# EAGLE design atsams70n-switch (EAGLE 8.3.2)
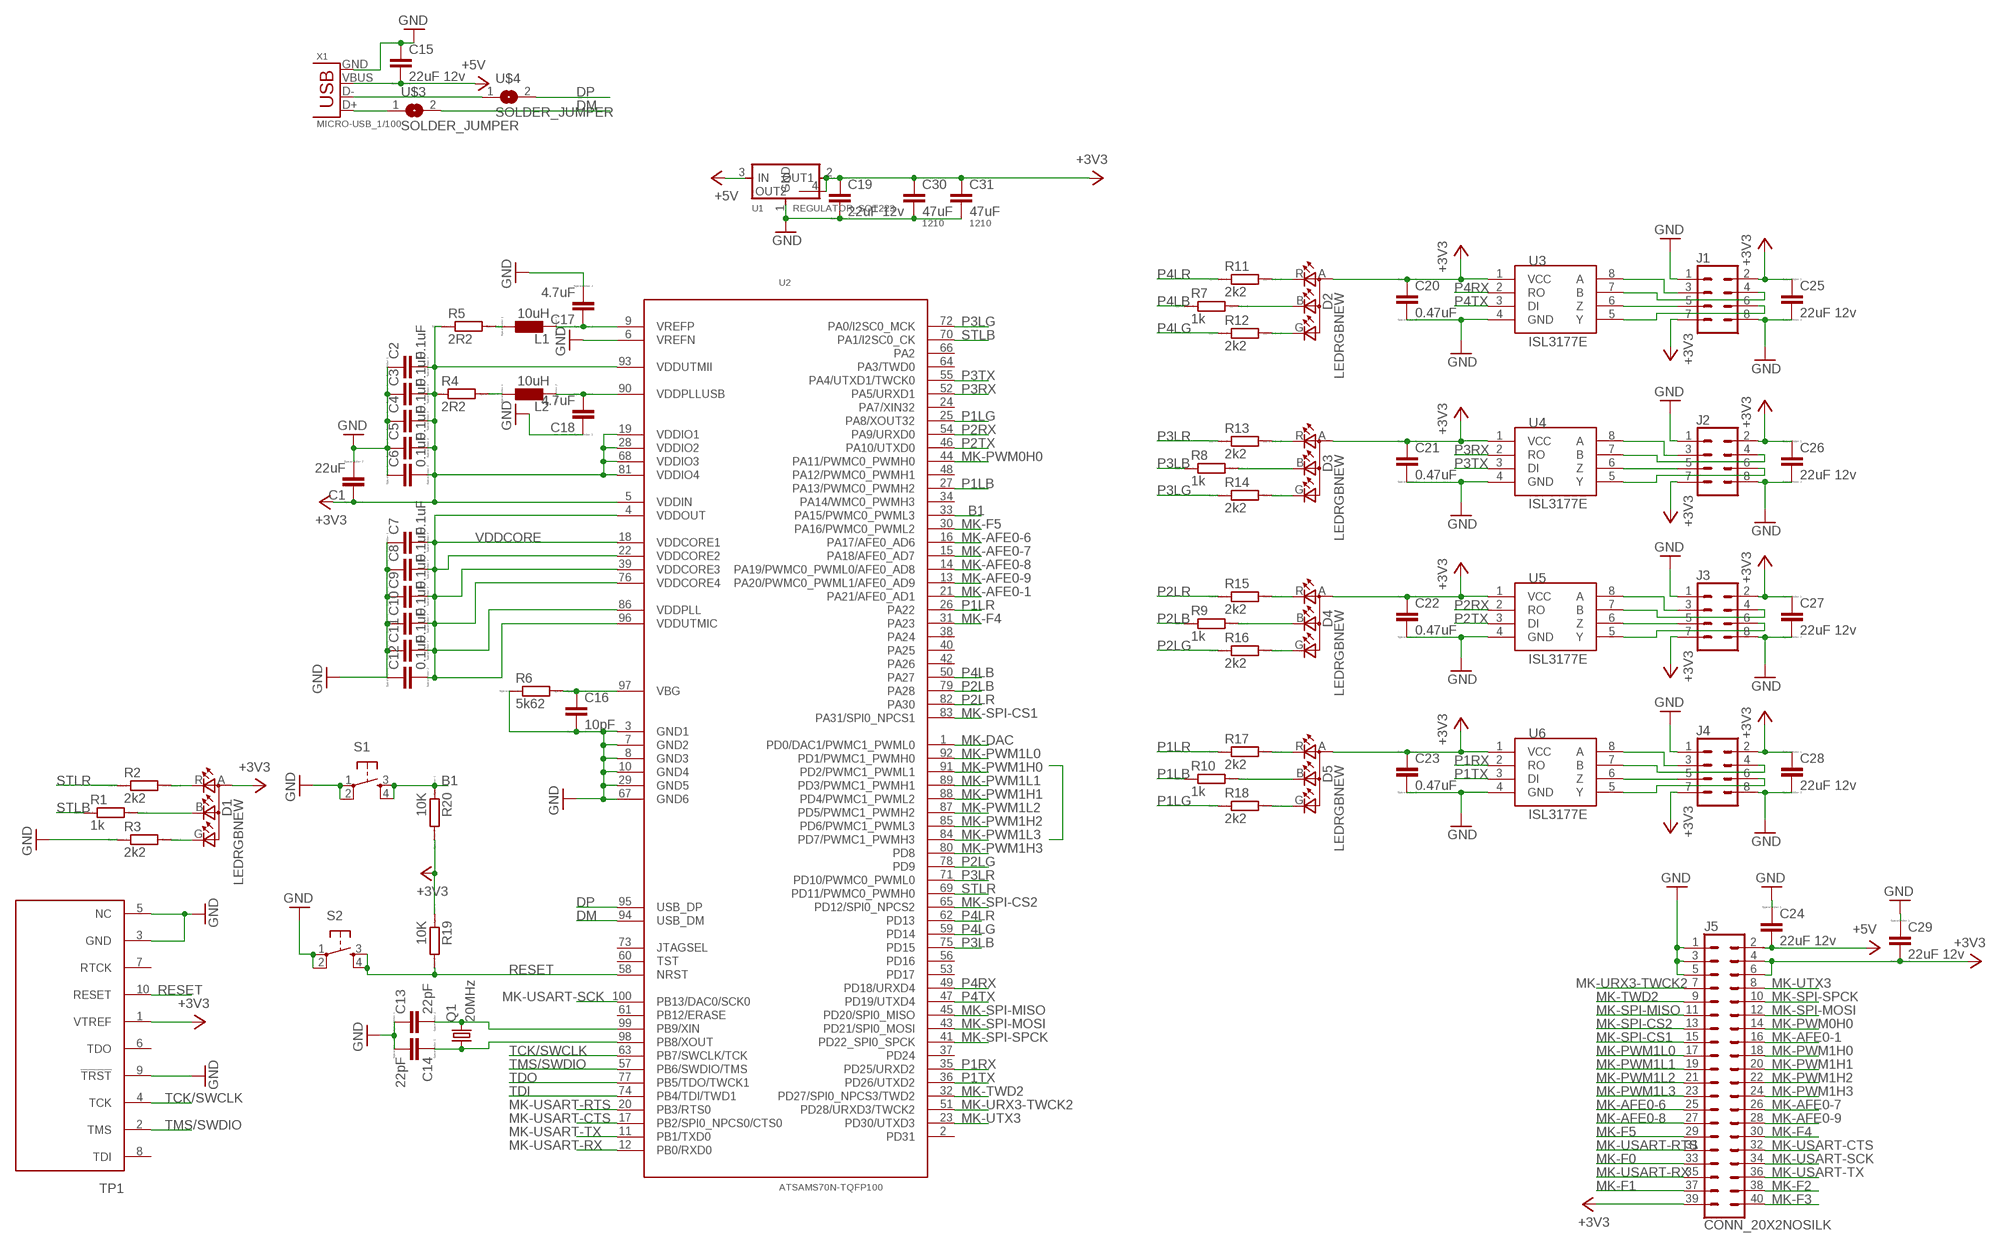
[diagram p0: schematic, sheet 1]

## Parts
C1  22uF  C  [C0805]
C2  0.1uF  CC0603  [C0603]
C3  0.1uF  CC0603  [C0603]
C4  0.1uF  CC0603  [C0603]
C5  0.1uF  CC0603  [C0603]
C6  0.1uF  CC0603  [C0603]
C7  0.1uF  CC0603  [C0603]
C8  0.1uF  CC0603  [C0603]
C9  0.1uF  CC0603  [C0603]
C10  0.1uF  CC0603  [C0603]
C11  0.1uF  CC0603  [C0603]
C12  0.1uF  CC0603  [C0603]
C13  22pF  CC0603  [C0603]
C14  22pF  CC0603  [C0603]
C15  22uF 12v  C  [C0805]
C16  10pF  C  [C0805]
C17  4.7uF  C  [C0805]
C18  4.7uF  C  [C0805]
C19  22uF 12v  C  [C0805]
C20  0.47uF  C  [C0805]
C21  0.47uF  C  [C0805]
C22  0.47uF  C  [C0805]
C23  0.47uF  C  [C0805]
C24  22uF 12v  C  [C0805]
C25  22uF 12v  C  [C0805]
C26  22uF 12v  C  [C0805]
C27  22uF 12v  C  [C0805]
C28  22uF 12v  C  [C0805]
C29  22uF 12v  C  [C0805]
C30  47uF  CAP1210  [1210]
C31  47uF  CAP1210  [1210]
D1  LEDRGBNEW  [P-LCC-4]
D2  LEDRGBNEW  [P-LCC-4]
D3  LEDRGBNEW  [P-LCC-4]
D4  LEDRGBNEW  [P-LCC-4]
D5  LEDRGBNEW  [P-LCC-4]
J1  CONN_04X2SHROUDED  [2X4-SHROUDED]
J2  CONN_04X2SHROUDED  [2X4-SHROUDED]
J3  CONN_04X2SHROUDED  [2X4-SHROUDED]
J4  CONN_04X2SHROUDED  [2X4-SHROUDED]
J5  CONN_20X2NOSILK  [2X20_NOSILK]
L1  10uH  L  [L1812]
L2  10uH  L  [L1812]
Q1  20MHz  CRYSTALCTS406  [CTS406]
R1  1k  R  [R0805]
R2  2k2  R  [R0805]
R3  2k2  R  [R0805]
R4  2R2  R  [R0805]
R5  2R2  R  [R0805]
R6  5k62  R  [R0805]
R7  1k  R  [R0805]
R8  1k  R  [R0805]
R9  1k  R  [R0805]
R10  1k  R  [R0805]
R11  2k2  R  [R0805]
R12  2k2  R  [R0805]
R13  2k2  R  [R0805]
R14  2k2  R  [R0805]
R15  2k2  R  [R0805]
R16  2k2  R  [R0805]
R17  2k2  R  [R0805]
R18  2k2  R  [R0805]
R19  10K  R  [R0805]
R20  10K  R  [R0805]
S1  6MM_SWITCH6MM_SWITCH  [6MM_SWITCH]
S2  6MM_SWITCH6MM_SWITCH  [6MM_SWITCH]
TP1  TC2050-NL  [TC2050-MCP]
U1  REGULATOR_SOT223  [SOT223]
U2  ATSAMS70N-TQFP100  [TQFP100-14X14]
U3  ISL3177E  [MSOP8]
U4  ISL3177E  [MSOP8]
U5  ISL3177E  [MSOP8]
U6  ISL3177E  [MSOP8]
U$3  SOLDER_JUMPER  [SJFAB]
U$4  SOLDER_JUMPER  [SJFAB]
X1  MICRO-USB_1/100  [DX4R005HJ5_100]

## Nets
+3V3: C1.1 C2.2 C3.2 C4.2 C5.2 C6.2 C19.1 C20.1 C21.1 C22.1 C23.1 C25.1 C26.1 C27.1 C28.1 C29.2 C30.1 C31.1 D1.A(A2) D2.A(A2) D3.A(A2) D4.A(A2) D5.A(A2) J1.2 J1.7 J2.2 J2.7 J3.2 J3.7 J4.2 J4.7 J5.4 J5.6 J5.39 R4.1 R5.1 R19.1 R20.2 TP1.1(VTREF) U1.2(OUT1) U1.4(OUT2) U2.5(VDDIN) U2.19(VDDIO1) U2.28(VDDIO2) U2.68(VDDIO3) U2.81(VDDIO4) U2.93(VDDUTMII) U3.1(VCC) U4.1(VCC) U5.1(VCC) U6.1(VCC)
+5V: C15.2 C24.2 J5.2 U1.3(IN) X1.VBUS
B1: R20.1 S1.3(S) S1.4(S1) U2.33(PA15/PWMC0_PWML3)
DM: U2.94(USB_DM) U$3.2
DP: U2.95(USB_DP) U$4.2
GND: C1.2 C2.1 C3.1 C4.1 C5.1 C6.1 C7.1 C8.1 C9.1 C10.1 C11.1 C12.1 C13.1 C14.2 C15.1 C16.2 C17.2 C18.1 C19.2 C20.2 C21.2 C22.2 C23.2 C24.1 C25.2 C26.2 C27.2 C28.2 C29.1 C30.2 C31.2 J1.1 J1.8 J2.1 J2.8 J3.1 J3.8 J4.1 J4.8 J5.1 J5.3 J5.5 R3.1 R6.1 S1.1(P) S1.2(P1) S2.1(P) S2.2(P1) TP1.3(GND) TP1.5(NC) TP1.9(!TRST) U1.1(GND) U2.3(GND1) U2.6(VREFN) U2.7(GND2) U2.8(GND3) U2.10(GND4) U2.29(GND5) U2.67(GND6) U3.4(GND) U4.4(GND) U5.4(GND) U6.4(GND) X1.GND
MK-AFE0-1: J5.16 U2.21(PA21/AFE0_AD1)
MK-AFE0-6: J5.25 U2.16(PA17/AFE0_AD6)
MK-AFE0-7: J5.26 U2.15(PA18/AFE0_AD7)
MK-AFE0-8: J5.27 U2.14(PA19/PWMC0_PWML0/AFE0_AD8)
MK-AFE0-9: J5.28 U2.13(PA20/PWMC0_PWML1/AFE0_AD9)
MK-DAC: U2.1(PD0/DAC1/PWMC1_PWML0)
MK-F0: J5.33
MK-F1: J5.37
MK-F2: J5.38
MK-F3: J5.40
MK-F4: J5.30 U2.31(PA23)
MK-F5: J5.29 U2.30(PA16/PWMC0_PWML2)
MK-PWM0H0: J5.14 U2.44(PA11/PWMC0_PWMH0)
MK-PWM1H0: J5.18 U2.91(PD2/PWMC1_PWML1)
MK-PWM1H1: J5.20 U2.88(PD4/PWMC1_PWML2)
MK-PWM1H2: J5.22 U2.85(PD6/PWMC1_PWML3)
MK-PWM1H3: J5.24 U2.80(PD8)
MK-PWM1L0: J5.17 U2.92(PD1/PWMC1_PWMH0)
MK-PWM1L1: J5.19 U2.89(PD3/PWMC1_PWMH1)
MK-PWM1L2: J5.21 U2.87(PD5/PWMC1_PWMH2)
MK-PWM1L3: J5.23 U2.84(PD7/PWMC1_PWMH3)
MK-SPI-CS1: J5.15 U2.83(PA31/SPI0_NPCS1)
MK-SPI-CS2: J5.13 U2.65(PD12/SPI0_NPCS2)
MK-SPI-MISO: J5.11 U2.45(PD20/SPI0_MISO)
MK-SPI-MOSI: J5.12 U2.43(PD21/SPI0_MOSI)
MK-SPI-SPCK: J5.10 U2.41(PD22_SPI0_SPCK)
MK-TWD2: J5.9 U2.32(PD27/SPI0_NPCS3/TWD2)
MK-URX3-TWCK2: J5.7 U2.51(PD28/URXD3/TWCK2)
MK-USART-CTS: J5.32 U2.17(PB2/SPI0_NPCS0/CTS0)
MK-USART-RTS: J5.31 U2.20(PB3/RTS0)
MK-USART-RX: J5.35 U2.12(PB0/RXD0)
MK-USART-SCK: J5.34 U2.100(PB13/DAC0/SCK0)
MK-USART-TX: J5.36 U2.11(PB1/TXD0)
MK-UTX3: J5.8 U2.23(PD30/UTXD3)
N$1: D5.R(CRED) R17.2
N$2: D5.B(CBLUE) R10.2
N$3: D5.G(CGREEN) R18.2
N$4: C13.2 Q1.3 U2.99(PB9/XIN)
N$5: C14.1 Q1.1 U2.98(PB8/XOUT)
N$6: U$4.1 X1.D-
N$7: C16.1 R6.2 U2.97(VBG)
N$8: L2.1 R4.2
N$9: L1.1 R5.2
N$10: C18.2 L2.2 U2.90(VDDPLLUSB)
N$11: C17.1 L1.2 U2.9(VREFP)
N$12: D1.R(CRED) R2.2
N$13: J3.3 U5.8(A)
N$14: J3.4 U5.7(B)
N$15: J3.5 U5.6(Z)
N$16: J3.6 U5.5(Y)
N$17: D4.R(CRED) R15.2
N$18: D4.B(CBLUE) R9.2
N$19: D4.G(CGREEN) R16.2
N$20: J2.3 U4.8(A)
N$21: J2.4 U4.7(B)
N$22: J2.5 U4.6(Z)
N$23: J2.6 U4.5(Y)
N$24: D3.R(CRED) R13.2
N$25: J4.3 U6.8(A)
N$26: J4.4 U6.7(B)
N$27: J4.5 U6.6(Z)
N$28: J4.6 U6.5(Y)
N$29: D3.B(CBLUE) R8.2
N$30: D3.G(CGREEN) R14.2
N$31: J1.3 U3.8(A)
N$32: J1.4 U3.7(B)
N$33: J1.5 U3.6(Z)
N$34: J1.6 U3.5(Y)
N$35: D2.R(CRED) R11.2
N$36: D2.B(CBLUE) R7.2
N$37: D2.G(CGREEN) R12.2
N$38: D1.B(CBLUE) R1.2
N$39: D1.G(CGREEN) R3.2
N$40: U$3.1 X1.D+
P1LB: R10.1 U2.27(PA13/PWMC0_PWMH2)
P1LG: R18.1 U2.25(PA8/XOUT32)
P1LR: R17.1 U2.26(PA22)
P1RX: U2.35(PD25/URXD2) U6.2(RO)
P1TX: U2.36(PD26/UTXD2) U6.3(DI)
P2LB: R9.1 U2.79(PA28)
P2LG: R16.1 U2.78(PD9)
P2LR: R15.1 U2.82(PA30)
P2RX: U2.54(PA9/URXD0) U5.2(RO)
P2TX: U2.46(PA10/UTXD0) U5.3(DI)
P3LB: R8.1 U2.75(PD15)
P3LG: R14.1 U2.72(PA0/I2SC0_MCK)
P3LR: R13.1 U2.71(PD10/PWMC0_PWML0)
P3RX: U2.52(PA5/URXD1) U4.2(RO)
P3TX: U2.55(PA4/UTXD1/TWCK0) U4.3(DI)
P4LB: R7.1 U2.50(PA27)
P4LG: R12.1 U2.59(PD14)
P4LR: R11.1 U2.62(PD13)
P4RX: U2.49(PD18/URXD4) U3.2(RO)
P4TX: U2.47(PD19/UTXD4) U3.3(DI)
RESET: R19.2 S2.3(S) S2.4(S1) TP1.10(RESET) U2.58(NRST)
STLB: R1.1 U2.70(PA1/I2SC0_CK)
STLR: R2.1 U2.69(PD11/PWMC0_PWMH0)
TCK/SWCLK: TP1.4(TCK) U2.63(PB7/SWCLK/TCK)
TDI: U2.74(PB4/TDI/TWD1)
TDO: U2.77(PB5/TDO/TWCK1)
TMS/SWDIO: TP1.2(TMS) U2.57(PB6/SWDIO/TMS)
VDDCORE: C7.2 C8.2 C9.2 C10.2 C11.2 C12.2 U2.4(VDDOUT) U2.18(VDDCORE1) U2.22(VDDCORE2) U2.39(VDDCORE3) U2.76(VDDCORE4) U2.86(VDDPLL) U2.96(VDDUTMIC)
Unconnected: TP1.6(TDO) TP1.7(RTCK) TP1.8(TDI) U2.2(PD31) U2.24(PA7/XIN32) U2.34(PA14/WMC0_PWMH3) U2.37(PD24) U2.38(PA24) U2.40(PA25) U2.42(PA26) U2.48(PA12/PWMC0_PWMH1) U2.53(PD17) U2.56(PD16) U2.60(TST) U2.61(PB12/ERASE) U2.64(PA3/TWD0) U2.66(PA2) U2.73(JTAGSEL)

## Library data of the parts
C1-C29 = eagle-ltspice:C: CAPACITOR, European symbol; SPICEMODEL: NONE; SPICEPREFIX: C
C30 C31 = borkedlabs-passives:CAP: Capacitor Standard 0603 ceramic capacitor, and 0.1" leaded capacitor.; PACKAGE: 1210
D1-D5 = fab:LEDRGBNEW
J1-J4 = fab:CONN_04X2: Multi connection point. Often used as Generic Header-pin footprint for 0.1 inch spaced/style header connections On any of the 0.1 inch spaced packages, you can populate with these: Break Away Headers - Straight <https://www.sparkfun.com/products/116> (PRT-00116) Break Away Male Headers - Right Angle <https://www.sparkfun.com/products/553> (PRT-00553) Female Headers <https://www.sparkfun.com/products/115> (PRT-00115) Break Away Headers - Machine Pin <https://www.sparkfun.com/products/117> (PRT-00117) Break Away Female Headers - Swiss Machine Pin <https://www.sparkfun.com/products/743> (PRT-00743)
J5 = SparkFun-Connectors:CONN_20X2: Multi connection point. Often used as Generic Header-pin footprint for 0.1 inch spaced/style header connections On any of the 0.1 inch spaced packages, you can populate with these: Break Away Headers - Straight <https://www.sparkfun.com/products/116> (PRT-00116) Break Away Male Headers - Right Angle <https://www.sparkfun.com/products/553> (PRT-00553) Female Headers <https://www.sparkfun.com/products/115> (PRT-00115) Break Away Headers - Machine Pin <https://www.sparkfun.com/products/117> (PRT-00117) Break Away Female Headers - Swiss Machine Pin <https://www.sparkfun.com/products/743> (PRT-00743)
L1 L2 = eagle-ltspice:L: INDUCTOR, European symbol; SPICEMODEL: NONE; SPICEPREFIX: L
Q1 = crystal:CRYSTAL: CRYSTAL; OC_FARNELL: unknown; OC_NEWARK: unknown
R1-R20 = eagle-ltspice:R: RESISTOR, European symbol; SPICEMODEL: NONE; SPICEPREFIX: R
S1 S2 = fab:6MM_SWITCH: OMRON SWITCH
TP1 = tag-connect-2050:TC2050-NL: TAG-CONNECT ISP Connector Manufacturer: Tag-Connect <www.tag-connect.com> Cable for easy In-Circuit PCB Programming. Designed for JTAG 10 pin, suitable for many others. Pin Connection for TC2050 NL. PAD Description 1 VTREF 2 TMS 3 GND 4 TCK 5 NC 6 TDO 7 RTCK 8 TDI 9 !TRST 10 RESET ©2009 ROFA.cz Modified 7/2011 by Tim McCarthy-Smith VIDA Products INC
U1 = fab:REGULATOR_SOT223
U2 = fab:ATSAMS70N-TQFP100
U3-U6 = fab:ISL3177E
U$3 U$4 = fab:SOLDER_JUMPER
X1 = fab:MICRO-USB: SMD micro USB connector as found in the fablab inventory. Three footprint variants included: original, as described by manufacturer's datasheet for milling with the 1/100" bit for milling with the 1/64" bit Made by Zaerc.

## Board
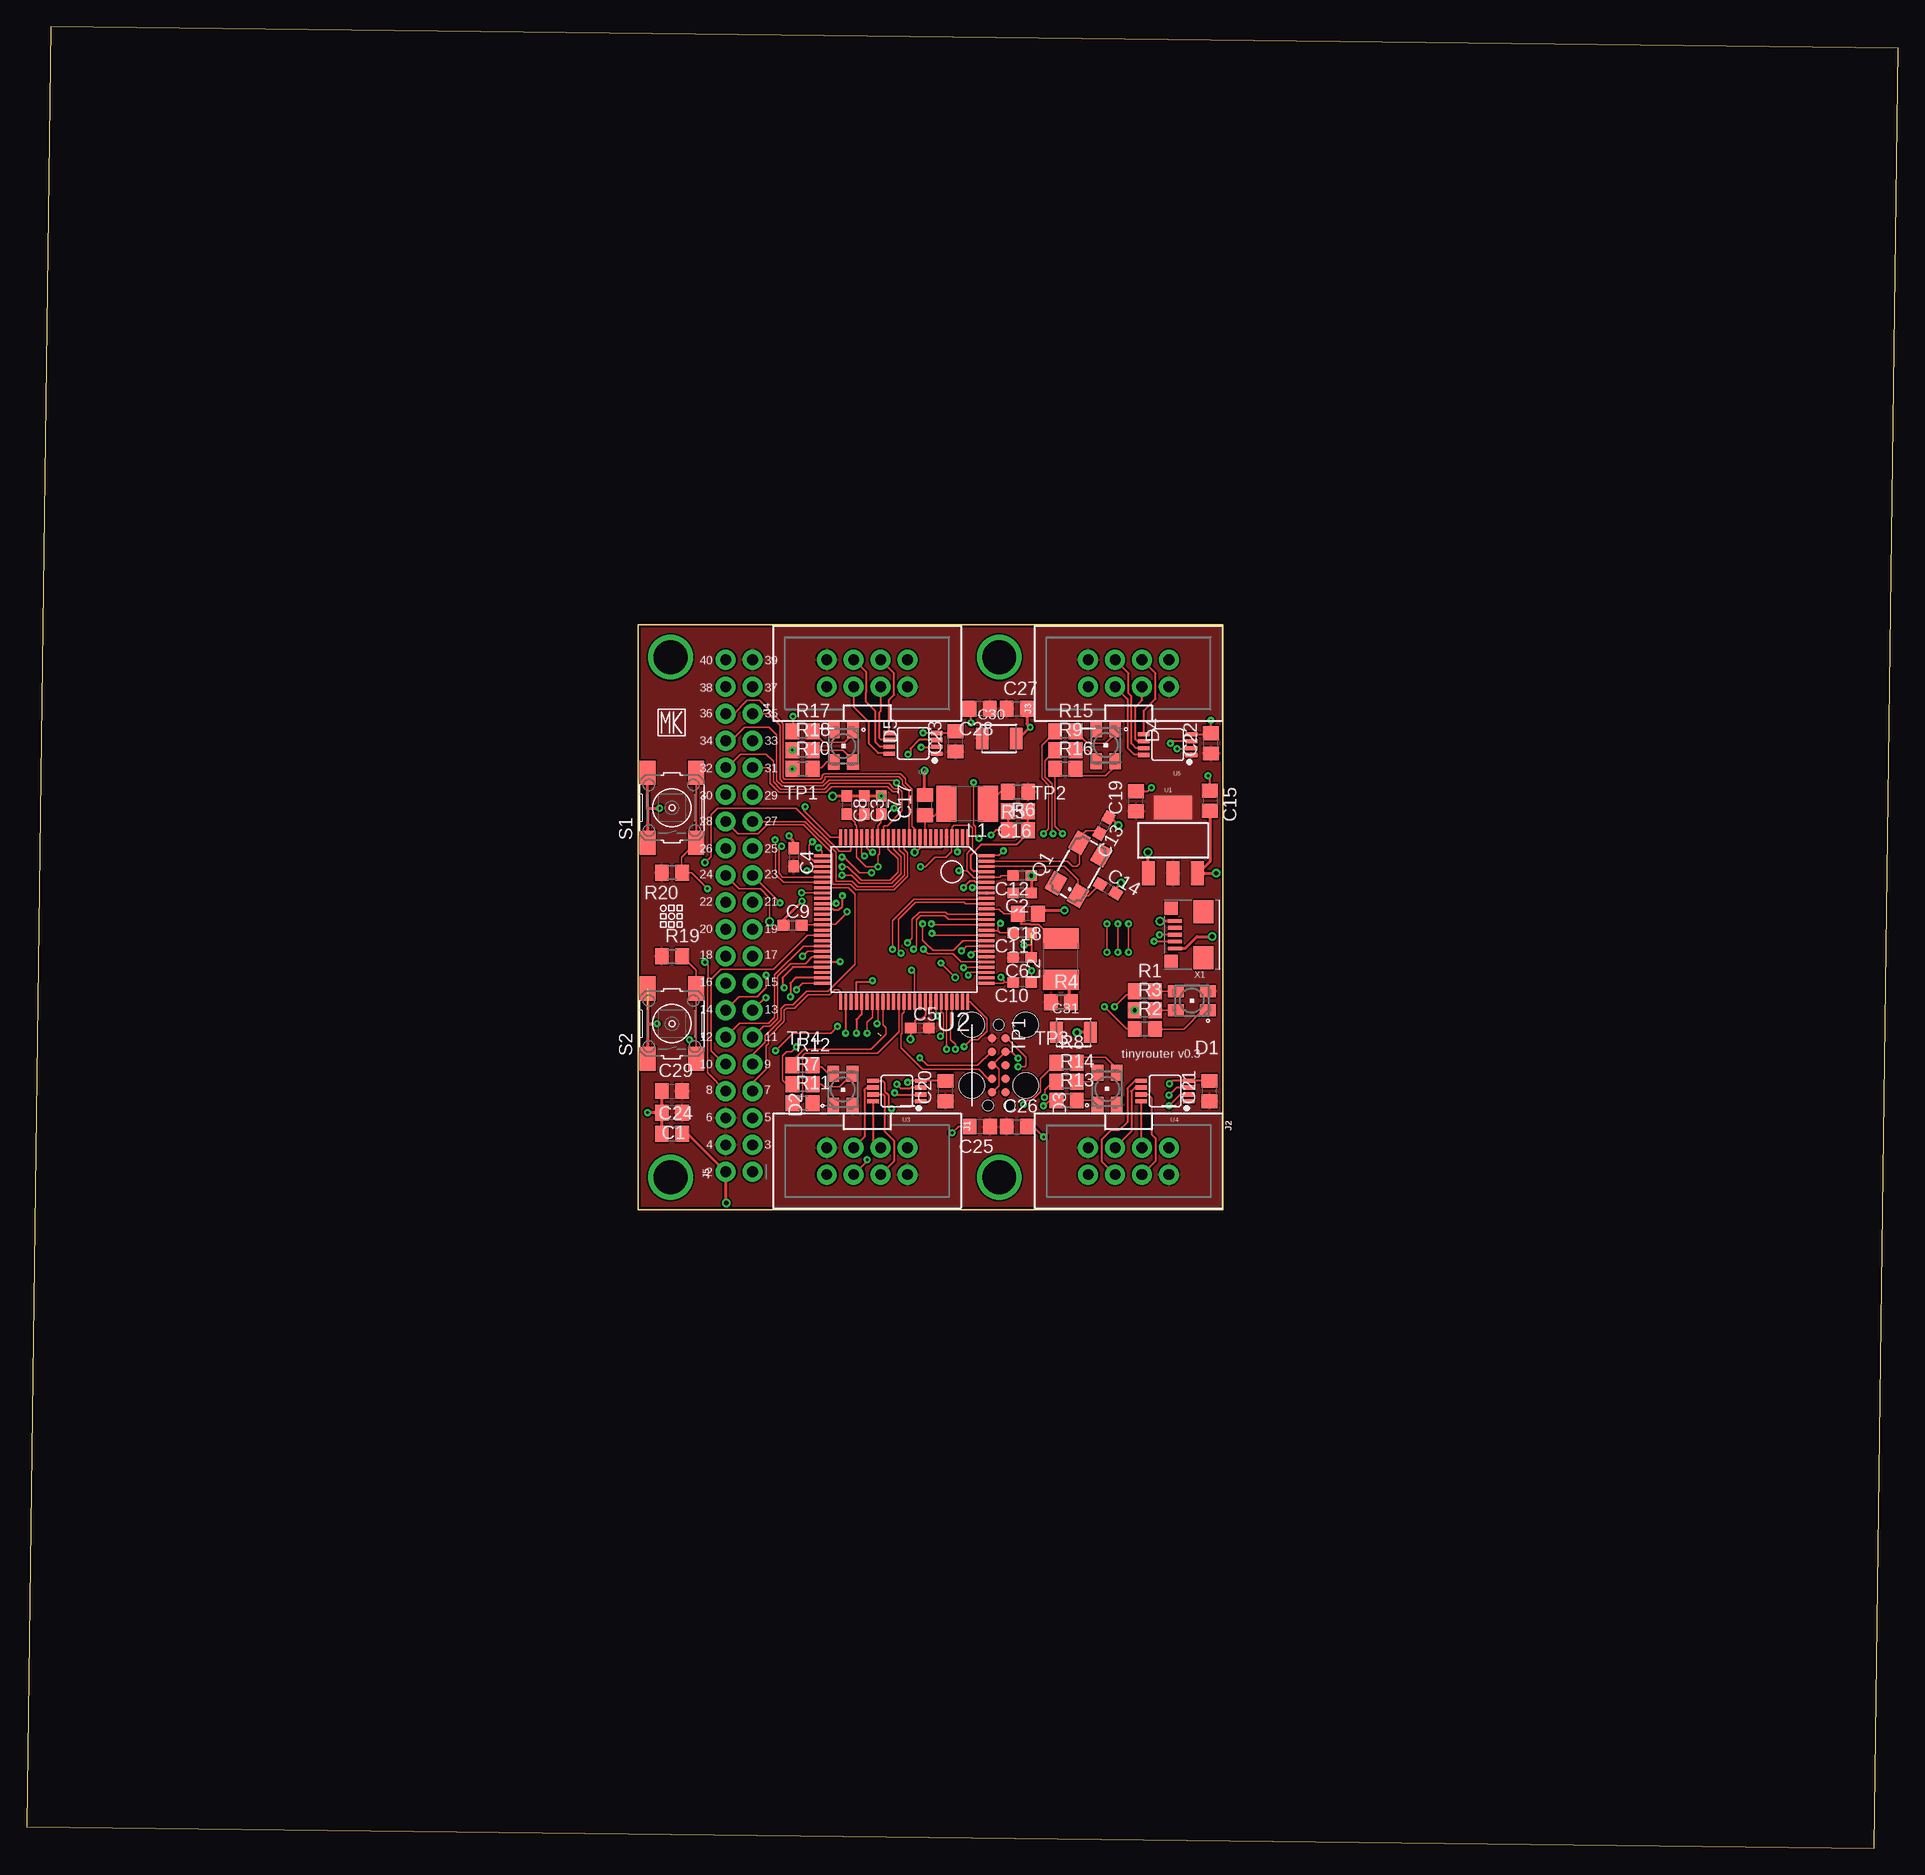
[diagram p1: board, top side]
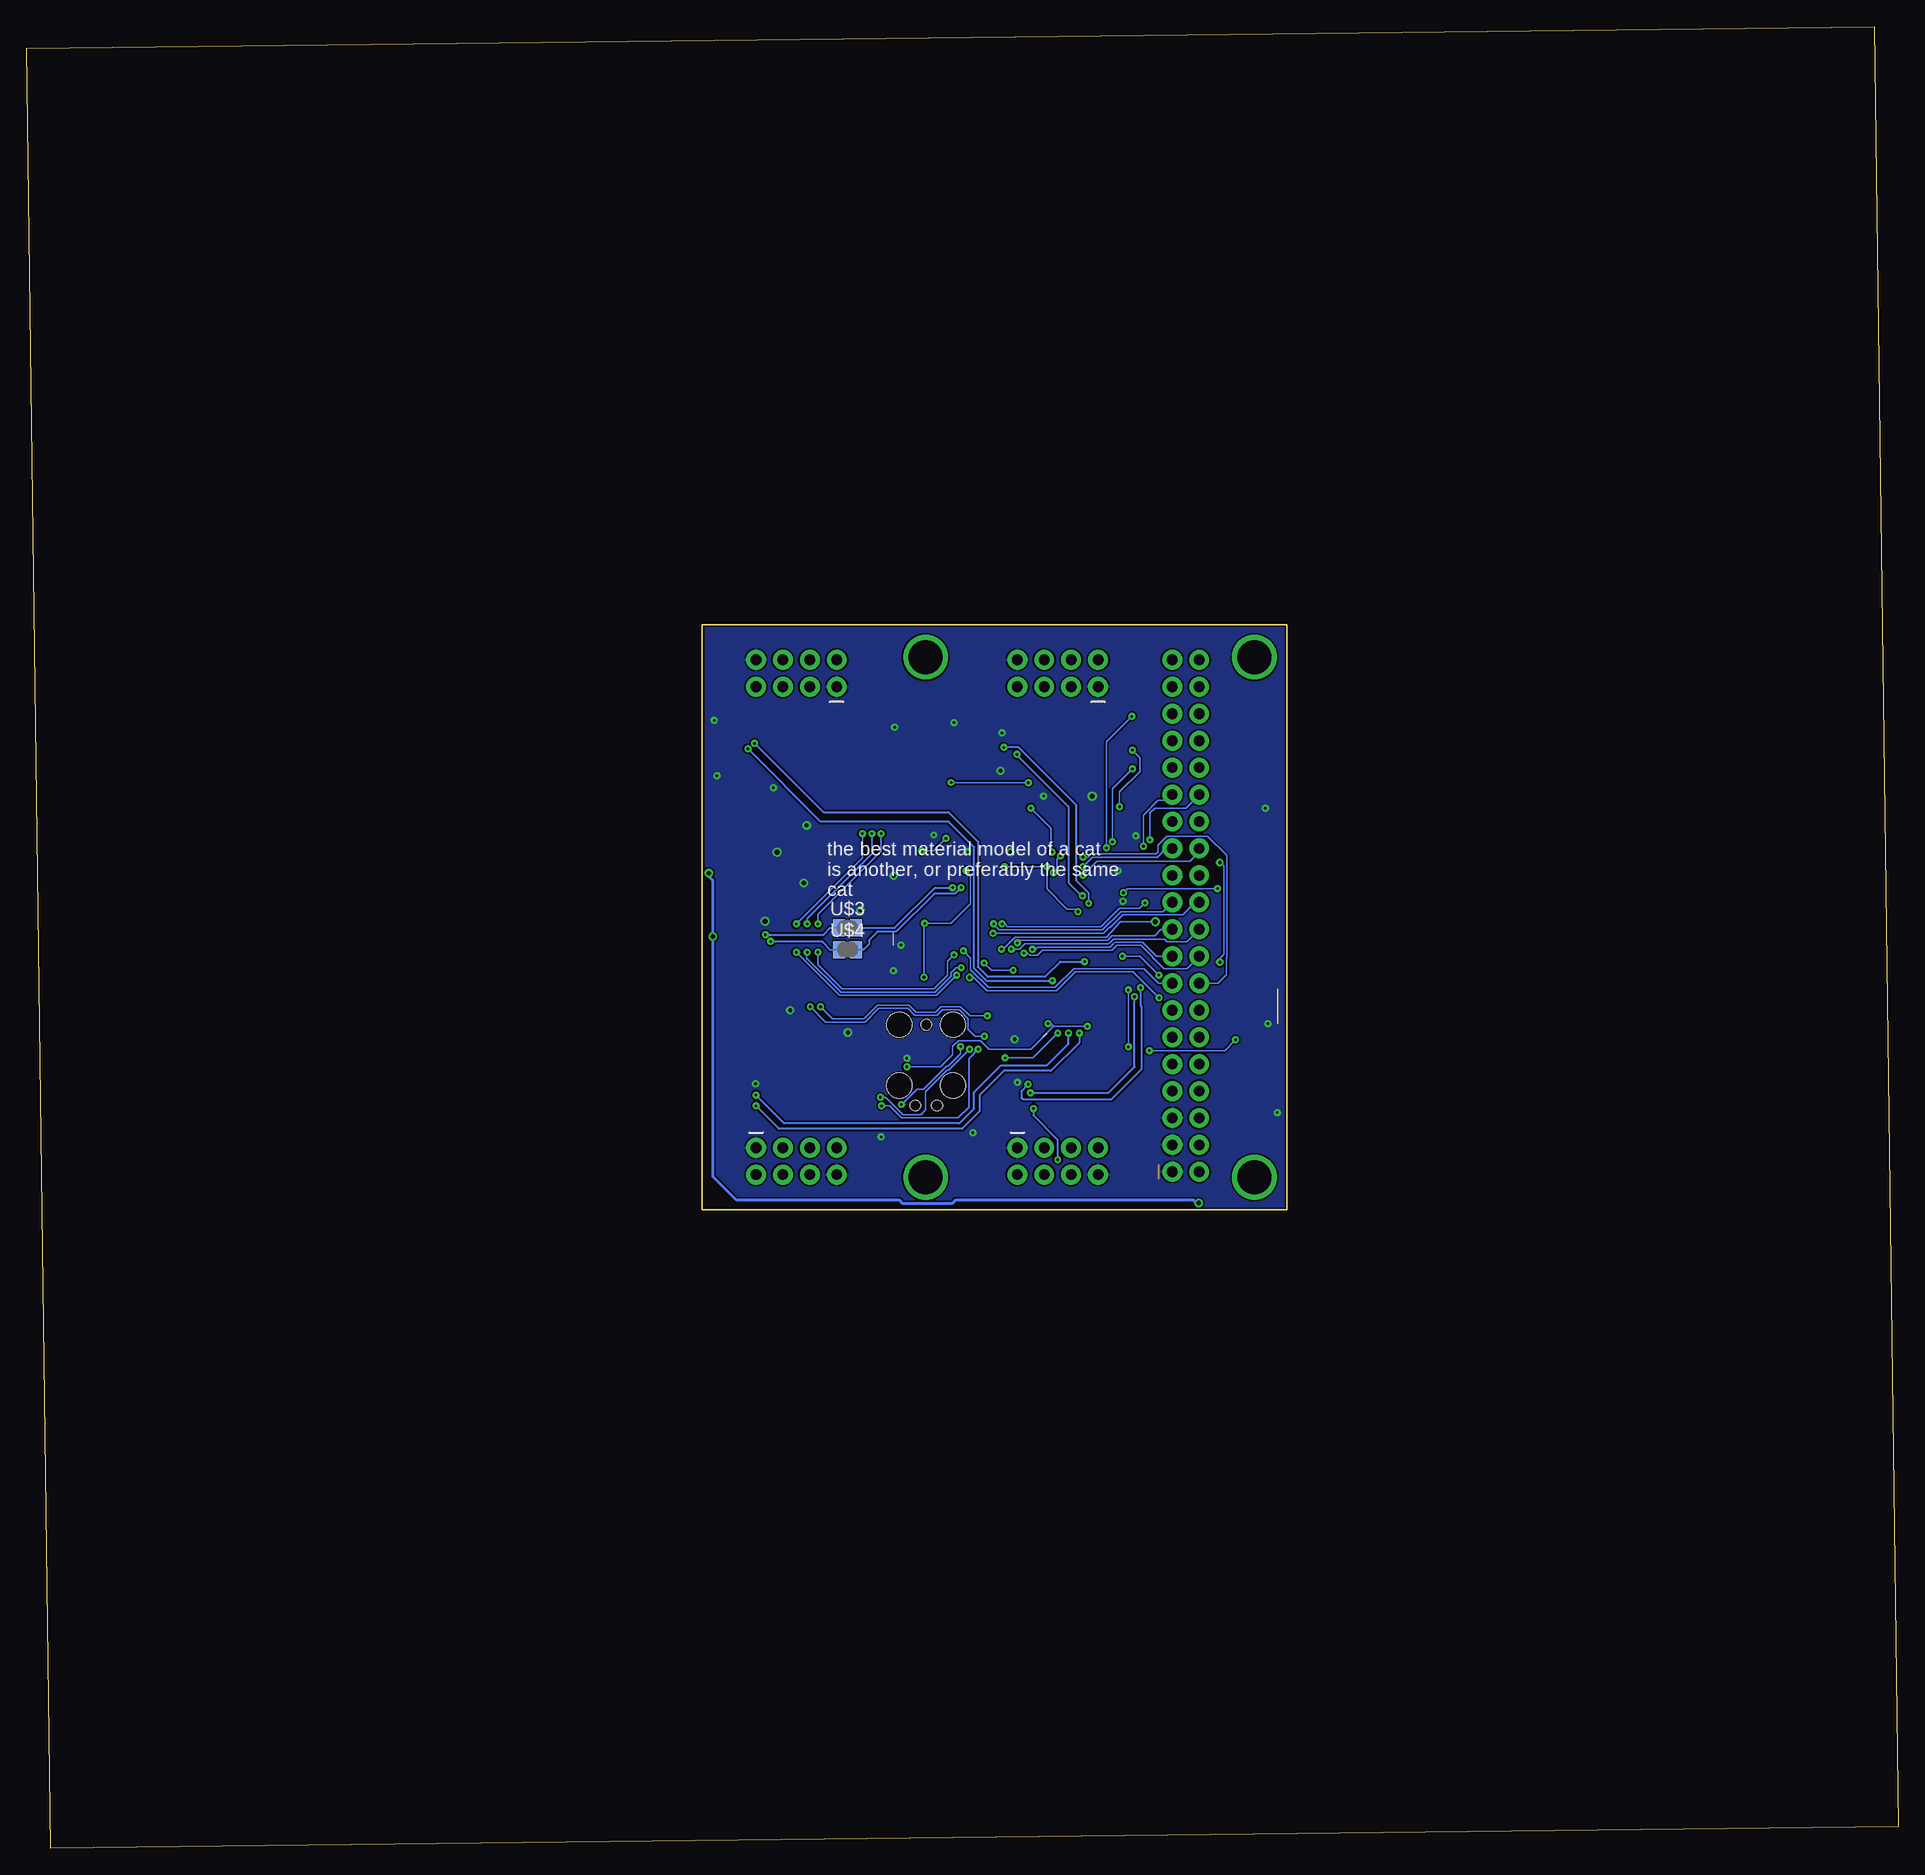
[diagram p2: board, bottom side, seen from below]

Size 176.45 x 171.69 mm. Coordinates in mm from the lower left corner, seen from the top.
Outline: 0,2.03 174.17,0 176.45,169.66 2.29,171.69 0,2.03
Outline: 57.66,115.32 57.66,60.2 112.78,60.2 112.78,115.32 57.66,115.32
Copper layers (1*16): Top 0.035mm / dielectric 1.5mm / Bottom 0.035mm
Design rules "default *": minimum track width 6mil, minimum drill 0.35mm, track to track 6mil, track to pad 6mil, pad to pad 6mil, via to via 6mil, smd to smd 6mil, copper to edge 6mil, drill to drill 6mil, minimum pad ring 10mil, minimum via ring 8mil, stop-mask expansion 4mil, vias tented up to drill 27mil, thermal gap 6mil
Milling: 4 lines

### Footprints (pad centres in the part's own frame; a part is rotated, then mirrored left to right if it is on the bottom)
C0805 = smd 1.3 x 1.5: 1 -0.95,0; 2 0.95,0
C0603 = smd 1.1 x 1: 1 -0.85,0; 2 0.85,0
1210 = smd 1.2 x 2: 1 -1.6,0; 2 1.6,0
P-LCC-4 = smd 1.1 x 1.5: A 0.902,-1.5; B 0.902,1.5; G -0.902,1.5; R -0.902,-1.5
2X4-SHROUDED = drill 1.016 pad 1.88: 1 -1.27,2.54; 2 1.27,2.54; 3 -1.27,0; 4 1.27,0; 5 -1.27,-2.54; 6 1.27,-2.54; 7 -1.27,-5.08; 8 1.27,-5.08
2X20_NOSILK = drill 1.016 pad 1.88: 1 0,0; 2 0,2.54; 3 2.54,0; 4 2.54,2.54; 5 5.08,0; 6 5.08,2.54; 7 7.62,0; 8 7.62,2.54; 9 10.16,0; 10 10.16,2.54; 11 12.7,0; 12 12.7,2.54; 13 15.24,0; 14 15.24,2.54; 15 17.78,0; 16 17.78,2.54; 17 20.32,0; 18 20.32,2.54; 19 22.86,0; 20 22.86,2.54; 21 25.4,0; 22 25.4,2.54; 23 27.94,0; 24 27.94,2.54; 25 30.48,0; 26 30.48,2.54; 27 33.02,0; 28 33.02,2.54; 29 35.56,0; 30 35.56,2.54; 31 38.1,0; 32 38.1,2.54; 33 40.64,0; 34 40.64,2.54; 35 43.18,0; 36 43.18,2.54; 37 45.72,0; 38 45.72,2.54; 39 48.26,0; 40 48.26,2.54
L1812 = smd 1.9 x 3.4: 1 -1.95,0; 2 1.95,0
CTS406 = smd 1.9 x 1.4: 1 -2.2,-1.2; 2 2.2,-1.2; 3 2.2,1.2; 4 -2.2,1.2
R0805 = smd 1.3 x 1.5: 1 -0.95,0; 2 0.95,0
6MM_SWITCH = smd 2.286 x 1.524: 1 -3.302,2.286; 2 3.302,2.286; 3 -3.302,-2.286; 4 3.302,-2.286
TC2050-MCP = smd 0.787 x 0.787: 1 1.27,-0.635; 2 2.54,-0.635; 3 3.81,-0.635; 4 5.08,-0.635; 5 6.35,-0.635; 6 6.35,0.635; 7 5.08,0.635; 8 3.81,0.635; 9 2.54,0.635; 10 1.27,0.635 | hole 1: 0,0; 7.62,-1.016; 7.62,1.016 | hole 2.375: 0,2.54; 0,-2.54; 5.715,2.54; 5.715,-2.54
SOT223 = smd 1.219 x 2.235: 1 -2.311,-3.099; 2 0,-3.099; 3 2.311,-3.099 | smd 3.6 x 2.2: 4 0,3.099
TQFP100-14X14 = smd 0.27 x 1.5: 1 -6,-7.75; 2 -5.5,-7.75; 3 -5,-7.75; 4 -4.5,-7.75; 5 -4,-7.75; 6 -3.5,-7.75; 7 -3,-7.75; 8 -2.5,-7.75; 9 -2,-7.75; 10 -1.5,-7.75; 11 -1,-7.75; 12 -0.5,-7.75; 13 0,-7.75; 14 0.5,-7.75; 15 1,-7.75; 16 1.5,-7.75; 17 2,-7.75; 18 2.5,-7.75; 19 3,-7.75; 20 3.5,-7.75; 21 4,-7.75; 22 4.5,-7.75; 23 5,-7.75; 24 5.5,-7.75; 25 6,-7.75; 51 6,7.75; 52 5.5,7.75; 53 5,7.75; 54 4.5,7.75; 55 4,7.75; 56 3.5,7.75; 57 3,7.75; 58 2.5,7.75; 59 2,7.75; 60 1.5,7.75; 61 1,7.75; 62 0.5,7.75; 63 0,7.75; 64 -0.5,7.75; 65 -1,7.75; 66 -1.5,7.75; 67 -2,7.75; 68 -2.5,7.75; 69 -3,7.75; 70 -3.5,7.75; 71 -4,7.75; 72 -4.5,7.75; 73 -5,7.75; 74 -5.5,7.75; 75 -6,7.75 | smd 1.5 x 0.27: 26 7.75,-6; 27 7.75,-5.5; 28 7.75,-5; 29 7.75,-4.5; 30 7.75,-4; 31 7.75,-3.5; 32 7.75,-3; 33 7.75,-2.5; 34 7.75,-2; 35 7.75,-1.5; 36 7.75,-1; 37 7.75,-0.5; 38 7.75,0; 39 7.75,0.5; 40 7.75,1; 41 7.75,1.5; 42 7.75,2; 43 7.75,2.5; 44 7.75,3; 45 7.75,3.5; 46 7.75,4; 47 7.75,4.5; 48 7.75,5; 49 7.75,5.5; 50 7.75,6; 76 -7.75,6; 77 -7.75,5.5; 78 -7.75,5; 79 -7.75,4.5; 80 -7.75,4; 81 -7.75,3.5; 82 -7.75,3; 83 -7.75,2.5; 84 -7.75,2; 85 -7.75,1.5; 86 -7.75,1; 87 -7.75,0.5; 88 -7.75,0; 89 -7.75,-0.5; 90 -7.75,-1; 91 -7.75,-1.5; 92 -7.75,-2; 93 -7.75,-2.5; 94 -7.75,-3; 95 -7.75,-3.5; 96 -7.75,-4; 97 -7.75,-4.5; 98 -7.75,-5; 99 -7.75,-5.5; 100 -7.75,-6
MSOP8 = smd 0.4 x 1.1: 1 -0.975,-2.25; 2 -0.325,-2.25; 3 0.325,-2.25; 4 0.975,-2.25; 5 0.975,2.25; 6 0.325,2.25; 7 -0.325,2.25; 8 -0.975,2.25
SJFAB = smd 1.118 x 1.6: 1 -0.787,0; 2 0.787,0
DX4R005HJ5_100 = smd 0.35 x 1.35: D+ 0,1.6; D- -0.65,1.6; GND 1.3,1.6; ID 0.65,1.6; VBUS -1.3,1.6 | smd 1.2 x 1.3: GND@1 -2.5,1.95; GND@2 2.5,1.95 | smd 2.15 x 1.9: GND@3 -2.175,-1.1; GND@4 2.175,-1.1

### Placement (x,y rotation side)
C1  60.83,69.34 180 top
C2  93.86,90.05 180 top
C3  78.96,98.32 270 top
C4  72.32,93.4 270 top
C5  84.2,77.32 0 top
C6  93.86,83.95 180 top
C7  80.57,98.32 270 top
C8  77.34,98.32 270 top
C9  72.2,87 0 top
C10  93.86,81.61 180 top
C11  93.86,86.28 180 top
C12  93.86,91.67 180 top
C13  101.58,96.4 240 top
C14  101.94,90.44 330 top
C15  111.56,98.73 270 top
C16  93.47,97.75 180 top
C17  84.7,98.32 90 top
C18  94.4,88.08 180 top
C19  104.6,98.68 90 top
C20  86.61,71.37 90 top
C21  111.51,71.37 90 top
C22  111.63,104.14 90 top
C23  87.57,104.32 90 top
C24  60.83,67.36 0 top
C25  89.86,68.03 180 top
C26  93.34,68.03 0 top
C27  93.34,107.38 0 top
C28  89.85,107.39 180 top
C29  60.83,71.37 0 top
C30  91.69,104.6 0 top
C31  98.7,76.9 0 top
D1  109.85,79.88 90 top
D2  76.96,71.5 0 top
D3  101.85,71.58 0 top
D4  101.73,103.96 180 top
D5  77.01,103.89 180 top
J1  80.52,64.77 270 top
J2  105.16,64.77 270 top
J3  102.62,110.74 90 top
J4  77.98,110.74 90 top
J5  68.45,63.75 90 top
L1  88.68,98.46 180 top
L2  97.5,83.81 90 top
Q1  99.19,92.27 60 top
R1  105.41,80.77 0 top
R2  105.41,77.22 0 top
R3  105.41,78.99 0 top
R4  97.51,79.76 0 top
R5  93.47,99.57 180 top
R6  93.47,95.96 0 top
R7  73.15,72.01 0 top
R8  98.04,74.04 0 top
R9  97.92,103.5 0 top
R10  73.15,101.73 0 top
R11  73.15,70.23 0 top
R12  73.15,73.79 0 top
R13  98.04,70.48 0 top
R14  98.04,72.26 0 top
R15  97.92,105.28 0 top
R16  97.92,101.73 0 top
R17  73.15,105.28 0 top
R18  73.15,103.5 0 top
R19  60.83,84.07 0 top
R20  60.83,91.95 180 top
S1  60.83,98.07 90 top
S2  60.83,77.72 90 top
TP1  91.65,77.62 270 top
U1  108.08,95 0 top
U2  82.73,87.54 180 top
U3  82.04,71.37 90 top
U4  107.31,71.37 90 top
U5  107.57,104.01 90 top
U6  83.57,104.14 90 top
U$1  [MK-LOGO-SILK]  60.8,106.1 0 top
U$2  [CBA-SILK-LOGO]  60.8,87.85 0 top
U$3  99.06,86.74 0 bottom
U$4  99.06,84.71 0 bottom
X1  109.85,86.11 90 top

### Tracks (layer width: path | path; a pad name or v marks a point on that pad's centre or on a via)
+3V3
  pour Top: 57.66,115.32 112.78,115.32 112.78,60.2 57.66,60.2
+5V  (via drill 0.4)
  Top 0.305: 65.91,63.68 J5.2 | C24.2 62.31,67.36 J5.2 | 110.43,91.86 110.47,91.82 | 110.43,91.86 U1.3 v112.14,91.9 | J5.2 65.91,60.87 v65.96,60.83 | v111.76,85.93 110.31,85.93 109.18,84.8 X1.VBUS | C15.2 111.56,92.98 110.43,91.86
  Bottom 0.305: v65.96,60.83 66.18,60.83 66.44,61.09 88.86,61.09 89.18,60.77 93.86,60.77 94.18,61.09 109.51,61.09 111.76,63.35 v111.76,85.93 111.76,91.26 112.14,91.64 v112.14,91.9
B1  (via drill 0.25)
  Top 0.152: S1.3 61.76,93.41 R20.1 62.69,91.95 v64.18,90.45 | v73.05,90.06 74.95,90.06 U2.33
  Top 0.203: S1.4 S1.3
  Bottom 0.152: v64.18,90.45 72.67,90.45 v73.05,90.06
DM  (via drill 0.25)
  Top 0.203: v89.15,90.55 U2.94
  Bottom 0.203: U$3.2 94.62,86.74 90.81,90.55 v89.15,90.55
DP  (via drill 0.25)
  Top 0.203: 90.46,91.06 U2.95 89.49,91.04 89.39,91.13 88.91,91.13 88.57,90.79 88.57,90.78 v88.34,90.55
  Bottom 0.203: v88.34,90.55 88.57,90.32 88.57,90.31 88.91,89.97 90.88,89.97 94.47,86.39 96.24,86.39 97.03,85.6 97.03,85.22 97.54,84.71 U$4.2
GND  (via drill 0.25, 0.35, 0.4, 0.45)  (2 unrouted)
  Top 0.152: U2.8 85.24,95.28 85.24,94.28 | 85.24,94.28 84.28,94.28 | 84.28,94.28 84.23,94.34 U2.10 | 84.28,94.28 83.87,93.88 v83.72,93.88 | U2.3 87.74,95.27 v87.74,93.91 | 85.75,94.28 85.24,94.28 | 85.75,94.28 85.73,94.31 U2.7 | U2.6 86.26,95.26 86.26,94.28 85.75,94.28 | U2.29 73.67,92.04 v73.56,92.15 | TP1.5 91.08,71.27 91.69,71.88 91.69,72.25 91.66,72.28 91.66,72.8 91.69,72.83 91.69,73.41 91.29,73.81 TP1.3 TP1.9 92.86,75.08 v93.47,74.47 | C10.1 94.71,82.52 v94.74,82.71
  Top 0.203: C16.2 R6.1 91.38,95.96 v90.93,95.5 | U2.67 84.73,79.78 84.73,78.54 84.33,78.13 83.87,78.13 83.87,78.12 83.77,78.02 83.77,77.88 83.35,77.46 C5.1 83.31,77.28 v83.31,76.25 | v83.06,72.18 83.22,72.35 U3.4 84.32,72.32 C20.2 | C21.2 111.48,72.35 U4.4 108.02,72.35 v107.73,72.06 | C15.1 111.56,100.91 v111.38,101.09 | C19.2 105.72,99.63 v106.05,99.95 | C23.2 87.4,105.12 U6.4 84.52,105.12 v84.51,105.13 | U5.4 111.53,104.99 C22.2 v111.63,106.3 | C11.1 C6.1 | 94.71,85.13 v94.02,85.13 | C25.2 87.84,68.03 v87.25,67.44 | C26.2 94.91,68.03 v95.88,67.06 | C28.2 v89.03,106.1 v89.02,106.09
  Top 0.305: U1.1 105.72,91.95 v105.72,93.88 | X1.GND 108.22,87.38 v106.83,87.38 | C7.1 C3.1 C8.1 v76,99.16 | C17.2 84.63,99.34 v84.63,101.55 | C12.1 C2.1 | C18.1 95.66,88.39 v97.84,88.39 | 102.05,97.14 C13.1 102.2,97.14 v102.92,96.42 | C14.2 102.68,90.48 v103.17,90.98 | C9.1 71.35,87.51 v73.1,89.26 | C4.1 72.32,94.81 v71.88,95.41 | 58.55,97.92 S1.2 | 58.55,97.92 S1.1 | v59.69,98.02 59.64,97.97 58.6,97.97 58.55,97.92 | S2.2 S2.1 | 58.55,77.72 v59.44,77.72 | C29.1 C1.2 | C1.2 C24.1 | C1.2 v58.55,69.34 | C31.2 v99.02,76.9 | v99.02,76.9 | C30.2 93.56,104.61 v94.62,105.66 94.29,105.99 C27.2
  other vias: 104.46,78.99 94.71,91.67 80.57,99.17
  pour Bottom: 57.66,115.32 112.78,115.32 112.78,60.2 57.66,60.2
MK-AFE0-1  (via drill 0.25)
  Top 0.152: U2.21 78.73,93.79 v78.99,93.52 | v79.65,91.95 78.53,91.95 77.06,93.42 v76.86,93.42
  Bottom 0.152: v78.99,93.52 79.3,93.22 79.3,92.31 v79.65,91.95 | v76.86,93.42 76.41,93.42 76.11,93.73 69.98,93.73 69.81,93.89 69.81,94.53 68.94,95.4 65.13,95.4 63.3,93.57 63.3,83.97 63.35,83.92 63.35,82.35 64.16,81.53 J5.16
MK-AFE0-6  (via drill 0.25)
  Top 0.152: U2.16 81.23,94.18 82.14,93.27 82.14,91.97 81.41,91.24 78.69,91.24 77.41,92.52 v76.89,92.52
  Bottom 0.152: v76.89,92.52 75.98,93.42 69.85,93.42 69.04,94.23 J5.25
MK-AFE0-7  (via drill 0.25)
  Top 0.152: U2.15 81.74,95.28 81.74,94.18 82.45,93.47 82.45,91.84 81.53,90.93 78.54,90.93 77.76,91.71 v76.86,91.71
  Bottom 0.152: v76.86,91.71 75.55,93.02 66.8,93.02 65.91,93.9 J5.26
MK-AFE0-8
  Top 0.152: U2.14 82.25,95.27 82.25,94.13 82.75,93.62 82.75,91.72 81.66,90.63 78.33,90.63 77.81,91.15 77.56,91.15 | 77.56,91.15 | 77.56,91.15 76.3,91.15 76.3,93.6 | 76.3,93.6 | 73.13,96.77 | 73.13,96.77 J5.27 | 76.3,93.6 76.3,93.86 73.38,96.77 73.13,96.77
MK-AFE0-9
  Top 0.152: J5.28 67.08,95.61 68.94,95.61 69.8,96.47 73.26,96.47 75.96,93.77 76,93.73 76,90.84 77.68,90.84 78.21,90.32 81.79,90.32 83.06,91.59 83.06,93.83 82.73,94.16 U2.13
MK-F4  (via drill 0.25)
  Top 0.152: U2.31 71.34,91.04 70.61,91.77 70.61,95 v70.56,95.05
  Bottom 0.152: v70.56,95.05 70.56,96.98 70.54,97 70.54,97.59 70.08,98.04 67.18,98.04 J5.30
MK-F5  (via drill 0.25)
  Top 0.152: U2.30 71.27,91.54 70.92,91.9 70.92,94.18 v71.17,94.44
  Bottom 0.152: v71.17,94.44 71.17,97.38 69.8,98.75 69.01,98.75 J5.29
MK-PWM0H0  (via drill 0.25)
  Top 0.152: U2.44 73.62,84.54 v73.15,84.07 | v69.72,82.3 69.72,81.12 69.04,80.43 69.04,80.42 68.88,80.26 67.18,80.26 J5.14
  Bottom 0.152: v73.15,84.07 71.5,84.07 v69.72,82.3
MK-PWM1H0  (via drill 0.25)
  Top 0.152: U2.91 88.51,89.04 88.39,89.15 83.79,89.15 82.18,87.54 82.18,84.96 82.19,84.94 82.19,84.61 v82.44,84.37
  Bottom 0.152: v82.44,84.37 82.07,84.37 81.87,84.16 81.15,84.16 80.67,84.63 74.44,84.63 | J5.18 67.08,82.91 69.22,82.91 71.4,85.09 73.66,85.09 74.12,84.63 74.19,84.63 | 74.44,84.63 | 74.44,84.63 74.19,84.63 | 74.19,84.63
MK-PWM1H1  (via drill 0.25)
  Top 0.152: U2.88 86.91,87.54 86.57,87.88 84.26,87.88 83.87,87.5 83.87,85.01 v83.62,84.76
  Bottom 0.152: 82.49,85.1 | 82.49,85.1 82.32,85.27 74.78,85.27 74.66,85.27 74.42,85.27 74.41,85.28 74.4,85.28 74.39,85.28 | v83.62,84.76 82.83,84.76 82.49,85.1 | 74.39,85.28 | 74.39,85.28 | 74.39,85.28 74.32,85.37 74.23,85.46 74.14,85.55 74.06,85.63 74,85.7 69.19,85.7 68.94,85.45 67.08,85.45 J5.20
MK-PWM1H2  (via drill 0.25)
  Top 0.152: U2.85 85.52,86.06 v85.34,86.23
  Bottom 0.152: J5.22 66.29,89.15 67.46,87.99 73.1,87.99 74.27,86.82 74.35,86.82 74.93,86.23 v85.34,86.23
MK-PWM1H3  (via drill 0.25, 0.45)
  Top 0.152: U2.80 90.45,83.57 88.09,83.57 87.32,84.33 84.96,84.33 v84.54,84.75 | 70.21,87.48 v70.05,87.33 70.05,89.56 69.19,90.42 67.18,90.42 J5.24 65.91,91.82
  Bottom 0.152: v70.05,87.33 73.33,87.33 74.67,85.89 83.28,85.89 83.85,85.31 | 83.85,85.31 | v84.54,84.75 84.42,84.75 83.85,85.31
MK-PWM1L0  (via drill 0.25)
  Top 0.152: U2.92 90.4,89.46 83.67,89.46 81.64,87.43 v81.64,84.71
  Bottom 0.152: J5.17 69.95,84.07 71.27,85.4 73.86,85.4 73.92,85.33 73.93,85.33 73.99,85.26 74.09,85.16 74.18,85.07 74.26,84.98 74.31,84.94 81.13,84.94 81.35,84.71 v81.64,84.71
MK-PWM1L1  (via drill 0.25)
  Top 0.152: v83.05,85.33 83.48,85.76 83.48,87.55 84.18,88.24 86.64,88.24 86.84,88.04 U2.89
  Bottom 0.152: J5.19 69.49,86.61 70.1,86 74.14,86 74.36,85.76 74.45,85.67 74.53,85.59 74.54,85.59 74.54,85.58 74.66,85.58 82.8,85.58 v83.05,85.33
MK-PWM1L2  (via drill 0.25)
  Top 0.152: U2.87 86.49,87.04 | 86.49,87.04 86.47,87.04 | 86.49,87.04 85.37,87.04 v85.29,87.12
  Bottom 0.152: J5.21 69.32,88.29 73.3,88.29 75.03,86.56 76.3,86.56 76.31,86.57 84.8,86.57 85.29,87.05 v85.29,87.12
MK-PWM1L3  (via drill 0.25)
  Top 0.152: U2.84 88.28,85.54 87.38,84.63 85.46,84.63 85.11,84.98 85.09,84.98 84.48,85.6 v84.48,87.12 | v71.02,89.1 71.02,89.13 J5.23
  Bottom 0.152: v84.48,87.12 84.23,87.12 83.98,86.87 75.29,86.87 75.16,86.87 73.43,88.59 71.53,88.59 v71.02,89.1
MK-SPI-CS1  (via drill 0.25)
  Top 0.152: U2.83 88.59,85.04 v88.14,84.58
  Bottom 0.152: v88.14,84.58 87.45,83.9 87.45,82.79 85.79,81.13 79.48,81.13 77.71,82.91 71.12,82.91 69.75,81.53 J5.15
MK-SPI-CS2  (via drill 0.25, 0.3)
  Top 0.152: J5.13 69.62,80.16 v69.7,80.16 | 87.47,81.99 v87.55,82.07 v86.18,83.44 | v83.44,82.75 83.73,82.46 U2.65
  Bottom 0.152: v87.55,82.07 87.16,82.07 85.91,80.83 85.86,80.83 85.85,80.82 85.5,80.82 85.5,80.83 79.35,80.83 77.57,82.6 72.14,82.6 v69.7,80.16 | v83.44,82.75 85.5,82.75 v86.18,83.44
MK-SPI-MISO
  Top 0.152: U2.45 74.96,84.02 74.07,84.02 73.43,83.39 72.01,83.39 70.81,82.19 70.81,78.21 70.08,77.47 69.47,77.47 J5.11
MK-SPI-MOSI
  Top 0.152: J5.12 67.23,77.78 69.95,77.78 70.51,78.33 70.51,82.32 73.23,85.04 U2.43
MK-SPI-SPCK
  Top 0.152: U2.41 73.61,86.06 70.41,82.86 65.48,82.86 64.52,81.89 64.52,75.18 65.79,73.91 J5.10
MK-TWD2
  Top 0.152: J5.9 68.45,74.8 69.62,75.97 69.62,76.58 71.12,78.08 71.12,79.12 71.5,79.5 72.26,79.5 73.53,80.77 75.56,80.77 78.1,83.31 78.1,89.92 77.48,90.54 U2.32 | U2.32
MK-URX3-TWCK2
  Top 0.152: J5.7 68.45,72.14 69.72,73.41 69.72,75.64 69.93,75.84 69.93,76.46 71.42,77.95 71.42,79 71.63,79.2 72.39,79.2 73.66,80.47 75.69,80.47 76.16,80.94 76.54,80.94 76.71,80.77 76.71,79.81 U2.51
MK-USART-CTS
  Top 0.152: U2.17 80.77,95.34 80.77,96.27 80.9,96.39 81.15,96.39 82.55,97.79 82.55,99.57 82.24,99.88 81.79,99.88 81.29,100.37 75.76,100.37 75.22,99.83 71.08,99.83 70.41,100.5 70.41,102.44 69.72,103.12 67.31,103.12 66.04,101.85 J5.32
MK-USART-RTS  (via drill 0.25)
  Top 0.152: 68.45,101.73 J5.31 69.85,101.85 70.1,101.6 70.1,100.38 70.95,99.53 75.35,99.53 75.88,100.06 81.17,100.06 81.66,99.57 82.12,99.57 82.25,99.44 82.25,98.5 v81.79,98.04 81.91,98.17 | v79.76,93.9 79.59,93.9 79.25,94.23 79.25,95.27 U2.20
  Bottom 0.152: v81.79,98.04 79.88,96.14 79.88,94.02 v79.76,93.9
MK-USART-RX
  Top 0.152: U2.12 83.19,95.33 83.19,99.69 82.57,100.31 82.57,100.66 82.25,100.99 82.24,100.99 81.79,100.99 81.77,100.98 75.3,100.98 75.28,100.96 75.28,100.76 74.97,100.44 71.33,100.44 71.02,100.76 71.02,105.84 69.93,106.93 J5.35
MK-USART-SCK  (via drill 0.25)
  Top 0.152: v89.29,100.45 89.29,96.46 89.46,96.29 89.46,95.5 v89.78,95.18 | U2.100 90.51,93.57 91.66,93.57 v92.09,94 | J5.34 66.42,104.39 67.69,105.66 69.98,105.66 70.71,104.93 70.71,100.63 71.2,100.14 75.1,100.14 75.59,100.63 75.59,100.67 81.78,100.67 v82.02,100.43
  Bottom 0.152: v89.78,95.18 v89.79,95.18 90.97,94 v92.09,94 | v82.02,100.43 89.27,100.43 v89.29,100.45
MK-USART-TX
  Top 0.152: U2.11 83.73,96.11 83.49,96.34 83.49,99.82 82.88,100.43 82.88,100.79 82.37,101.3 75.19,101.3 74.98,101.09 74.98,100.88 74.85,100.75 71.46,100.75 71.32,100.88 71.32,105.97 69.09,108.2 67.94,108.2 66.67,106.93 J5.36
MK-UTX3  (via drill 0.3)
  Top 0.152: U2.23 77.72,94.11 77.61,93.99 76.59,93.99 76.43,94.16 72.54,98.04 65.15,98.04 64.52,97.41 64.52,93.47 v63.96,92.91 | J5.8 64.21,73.08 64.21,82.02 64.26,82.07 64.26,83.21 v63.96,83.52
  Bottom 0.152: v63.96,83.52 63.96,83.9 63.6,84.26 63.6,92.56 v63.96,92.91
N$1
  Top 0.152: D5.R 77.91,105.09 77.09,104.27 75.12,104.27 R17.2
N$2
  Top 0.152: D5.B 75.46,102.39 74.93,101.85 74.23,101.85 R10.2
N$3
  Top 0.152: D5.G 77.91,102.55 76.96,103.5 R18.2
N$4
  Top 0.152: U2.99 98.12,93.04 98.6,92.56 99.01,92.56 99.26,92.81 99.26,94.76 Q1.3 99.25,95.29 99.87,95.91 100.91,95.91 C13.2
  Top 0.203: 90.5,93.02 U2.99
N$5
  Top 0.152: U2.98 97.86,92.54 99.11,91.29 99.11,89.78 Q1.1 100.1,89.76 C14.1
N$6  (via drill 0.25)
  Top 0.203: X1.D- 106.31,85.46 v106.3,85.47
  Bottom 0.203: v106.3,85.47 101.47,85.47 100.71,84.71 U$4.1
N$7
  Top 0.203: U2.97 90.44,92.08 89.28,92.08 89.03,92.33 89.03,93.6 90.04,94.62 93.34,94.62 94.42,95.69 R6.2 C16.1
N$8
  Top 0.305: R4.2 98.3,80.24 98.3,81.53 97.98,81.86 L2.1
N$9
  Top 0.203: L1.1 90.72,98.46 91.82,99.57 R5.2
N$10
  Top 0.152: U2.90 90.5,88.52 91.69,88.52 92.13,88.08 C18.2
  Top 0.203: C18.2 93.73,87.8 93.73,87.12 94.55,87.12 94.6,87.08 95.38,87.08 96.54,85.91 L2.2
N$11
  Top 0.152: U2.9 84.7,95.31 84.7,97.28 C17.1
  Top 0.203: L1.2 85.55,97.28 84.7,97.28
N$12
  Top 0.152: D1.R 110.86,78.98 109.09,77.22 R2.2
N$13
  Top 0.203: J3.3 103.78,108.31 103.78,103.73 104.39,103.12 105.23,103.12 U5.8
N$14
  Top 0.203: U5.7 104.59,103.69 104.14,104.14 104.14,108.59 103.89,108.84 103.89,110.74 J3.4
N$15
  Top 0.203: U5.6 104.7,104.34 104.52,104.52 104.52,104.68 104.52,107.56 105.16,108.2 J3.5
N$16
  Top 0.203: U5.5 105.32,107.22 106.43,108.33 106.43,110.74 J3.6
N$17
  Top 0.152: D4.R 102.63,105.04 101.73,104.14 100.01,104.14 R15.2
N$18
  Top 0.152: D4.B 100.82,102.76 100.08,103.5 R9.2
N$19
  Top 0.152: D4.G 102.63,101.99 101.73,101.09 99.5,101.09 R16.2
N$20
  Top 0.203: U4.8 105.06,66.13 J2.3
N$21
  Top 0.203: U4.7 105.73,71.05 106.05,70.74 106.05,67.31 106.43,66.93 106.43,64.77 J2.4
N$22
  Top 0.203: U4.6 104.47,71.7 104.14,71.37 104.14,67.56 J2.5
N$23
  Top 0.203: U4.5 104.48,72.35 103.76,71.63 103.76,68.45 103,67.69 102.23,67.69 101.35,66.8 101.35,64.77 J2.6
N$24
  Top 0.152: R13.2 100.93,70.48 D3.R
N$25
  Top 0.203: J4.3 77.98,107.57 79.38,106.17 79.38,104.14 80.26,103.25 81.23,103.25 U6.8
N$26
  Top 0.203: U6.7 80.46,103.81 80.01,104.27 80.01,107.19 79.12,108.08 79.12,108.93 79.17,108.98 79.17,110.82 J4.4
N$27
  Top 0.203: J4.5 80.52,107.19 80.37,107.04 80.37,104.67 80.52,104.52 81.26,104.52 U6.6
N$28
  Top 0.203: U6.5 81.32,108.24 81.79,108.71 81.79,110.74 J4.6
N$29
  Top 0.152: D3.B 102.76,73.52 101.73,74.55 99.5,74.55 R8.2
N$30
  Top 0.152: D3.G 100.95,72.89 100.33,72.26 R14.2
N$31
  Top 0.203: U3.8 79.79,66.77 J1.3
N$32
  Top 0.203: U3.7 80.72,71.05 80.9,70.87 80.9,67.56 81.79,66.68 81.79,64.77 J1.4
N$33
  Top 0.203: U3.6 79.19,71.7 78.99,71.5 78.99,71.36 78.99,71.35 78.99,67.05 J1.5
N$34  (via drill 0.25)
  Top 0.203: 81.47,69.79 81.41,69.85 | 81.47,69.79 v81.53,69.72 | v79.25,64.9 79.25,64.77 J1.6 | U3.5 80.69,72.35 80.9,72.14 80.9,71.37 81.25,71.01 81.25,70 81.47,69.79
  Bottom 0.203: v81.53,69.72 81.53,69.09 79.25,66.8 v79.25,64.9
N$35
  Top 0.152: 74.13,70.39 74.38,70.64 | 74.13,70.39 R11.2 | D2.R 74.53,70 74.13,70.39
N$36
  Top 0.152: D2.B 76.62,71.75 75.18,71.75 74.93,72.01 R7.2
N$37
  Top 0.152: D2.G 75.59,73 74.93,73.66 74.36,73.66 R12.2
N$38
  Top 0.152: D1.B 106.37,80.78 R1.2
N$39
  Top 0.152: D1.G 106.37,78.98 R3.2
  Top 0.203: D1.G
N$40  (via drill 0.25)
  Top 0.203: X1.D+ v106.81,86.11
  Bottom 0.203: v106.81,86.11 101.35,86.11 100.71,86.74 U$3.1
N$41  (via drill 3.2)
  other vias: 91.69,63.25
N$42  (via drill 3.2)
  other vias: 91.69,112.27
N$43  (via drill 3.2)
  other vias: 60.71,63.25
N$44  (via drill 3.2)
  other vias: 60.71,112.27
P1LB  (via drill 0.25)
  Top 0.152: U2.27 74.22,93.04 73.79,93.47 73.79,94.56 v74.08,94.86
  Bottom 0.152: v74.08,94.86 74.08,99.85 R10.1
  other vias: 72.2,101.73
P1LG  (via drill 0.25)
  Top 0.152: U2.25 75.78,95.29 73.28,97.79 73.28,98.04 v73.41,98.17
  Bottom 0.152: v73.41,98.17 73.41,99.57 71.5,101.47 71.5,102.8 R18.1
  other vias: 72.2,103.5
P1LR  (via drill 0.25)
  Top 0.152: U2.26 74.98,93.96 v74.66,94.28 | v72.26,106.68 72.26,105.34 R17.1
  Bottom 0.152: v74.66,94.28 74.66,104.29 v72.26,106.68
P1RX  (via drill 0.25)
  Top 0.203: U2.35 76.31,89.04 v76.33,89.05 | v84.33,103.76 85.76,103.76 U6.2
  Bottom 0.203: 76.33,89.03 v76.33,89.05 76.33,90.04 77.47,91.19 77.47,98.3 82.93,103.76 v84.33,103.76
P1TX  (via drill 0.25)
  Top 0.203: v76.91,89.76 76.91,88.81 76.57,88.47 76.09,88.47 76.02,88.54 U2.36 | U6.3 84.14,104.47 83.31,103.63 83.31,103.32 v83.09,103.09
  Bottom 0.203: v76.91,89.76 77.01,89.76 78.23,90.98 78.23,98.17 83.09,103.03 v83.09,103.09
P2LB  (via drill 0.25)
  Top 0.152: U2.79 88.37,83.04 v88.34,83.01 | v102.87,84.46 v102.87,87.12 | R9.1 96.97,103.45 96.09,102.57 96.09,102.56 96.01,102.49 96.01,100.96 96.22,100.75 96.23,100.75 96.66,100.31 96.66,95.74 v96.77,95.63
  Bottom 0.152: v88.34,83.01 88.85,83.01 89.33,82.53 89.33,82.17 90.81,80.7 99.7,80.7 102.91,83.91 102.91,84.42 v102.87,84.46 | v102.87,87.12 102.87,87.63 96.77,93.73 v96.77,95.63
P2LG  (via drill 0.25)
  Top 0.152: R16.1 96.97,99.31 | 96.97,99.31 96.97,99.25 | v103.89,87.12 v103.89,84.46 | v88.77,82.3 89.03,82.55 U2.78 | 96.97,99.31 96.97,96.33 v97.66,95.63
  Bottom 0.152: v97.66,95.63 97.66,93.34 v103.89,87.12 | v103.89,84.46 99.82,80.39 90.68,80.39 v88.77,82.3
P2LR  (via drill 0.25)
  Top 0.152: R15.1 96.97,105.23 95.71,103.97 95.71,100.83 96.36,100.18 96.36,96.1 v95.88,95.63 | v101.85,87.12 v101.85,84.46 | U2.82 89.37,84.54 v89.03,84.2
  Bottom 0.152: v95.88,95.63 95.88,93.98 101.85,88.01 v101.85,87.12 | v101.85,84.46 101.85,83.28 99.57,81 90.93,81 89.63,82.3 89.63,83.59 v89.03,84.2
P2RX  (via drill 0.25)
  Top 0.203: U2.54 78.23,81.66 79.62,81.66 v79.76,81.79 | v108.46,103.63 109.76,103.63 U5.2
  Bottom 0.203: v79.76,81.79 85.98,81.79 87.12,82.93 87.12,94.36 89.53,96.77 101.6,96.77 v108.46,103.63
P2TX  (via drill 0.25)
  Top 0.203: U2.46 76.68,83.54 v76.71,83.57 | U5.3 108.02,104.34 v107.82,104.14
  Bottom 0.203: v76.71,83.57 78.99,83.57 80.39,82.17 85.81,82.17 85.83,82.14 86.77,83.08 86.77,83.68 86.74,83.71 86.74,94.87 89.53,97.66 101.35,97.66 v107.82,104.14 | v107.82,104.14
P3LB  (via drill 0.25)
  Top 0.152: U2.75 88.94,79.79 90.53,78.2 90.53,77.03 89.69,76.2 89.03,76.2 v88.39,75.56 | v93.98,70.1 94.36,70.49 94.78,70.49 95.6,71.32 95.6,72.55 R8.1
  Bottom 0.152: v88.39,75.56 88.39,74.9 89.58,73.71 89.74,73.71 91.88,71.56 92.52,71.56 v93.98,70.1
P3LG  (via drill 0.25)
  Top 0.152: R14.1 96.77,72.26 96.01,71.5 96.01,70.83 v95.96,70.79 | v87.55,75.31 87.55,75.77 87.12,76.2 87.12,78.74 87.23,78.84 U2.72
  Bottom 0.152: v95.96,70.79 95.5,70.79 93.85,69.14 92.15,69.14 91.69,69.6 91.69,71.32 89.69,73.32 89.54,73.32 v87.55,75.31
P3LR  (via drill 0.25)
  Top 0.152: R13.1 96.52,70.48 v95.85,69.98 | v86.74,75.31 86.74,79.78 U2.71
  Bottom 0.152: v95.85,69.98 95.12,69.98 93.98,68.83 88.65,68.83 87.63,69.85 87.63,74.42 v86.74,75.31
P3RX  (via drill 0.25)
  Top 0.203: U2.52 77.23,76.85 v77.22,76.84 | U4.2 108.77,71.05 v107.7,69.98
  Bottom 0.203: v77.22,76.84 77.22,75.95 79.88,73.28 84.33,73.28 86.61,70.99 86.61,69.47 88.27,67.82 105.54,67.82 v107.7,69.98
P3TX  (via drill 0.25)
  Top 0.203: v78.23,76.84 78.23,78.11 78.73,78.6 U2.55 | U4.3 108.4,71.7 v107.7,70.99
  Bottom 0.203: v78.23,76.84 78.23,75.82 80.26,73.79 84.58,73.79 87.12,71.25 87.12,69.72 88.52,68.33 105.03,68.33 v107.7,70.99
P4LB  (via drill 0.25)
  Top 0.152: v72.59,75.54 72.11,75.06 71.63,75.06 71.46,74.89 71.25,74.68 71.25,72.39 71.63,72.01 R7.1 | v72.59,80.9 72.59,80.97 73.15,81.53 U2.50
  Bottom 0.152: v72.59,75.54 v72.59,80.9
P4LG
  Top 0.152: R12.1 72.2,74.23 73.28,75.31 79.63,75.31 81.03,76.71 81.03,77.34 80.73,77.64 U2.59
P4LR
  Top 0.152: U2.62 82.25,79.77 82.25,76.96 80.21,74.93 73.41,74.93 73.37,74.89 73.36,74.89 73.15,74.69 73.15,70.61 72.9,70.36 72.33,70.36 R11.1
P4RX  (via drill 0.25)
  Top 0.203: U2.49 72.52,82.04 72.01,81.53 v72.01,80.26 | U3.2 84.24,70.99 82.04,70.99 v81.84,71.19
  Bottom 0.203: v72.01,80.26 72.01,73.66 74.47,71.19 v81.84,71.19
P4TX  (via drill 0.25)
  Top 0.203: U2.47 72.25,83.04 71.25,82.04 71.25,81.28 v71.43,81.1 | 84.36,71.63 U3.3 83.4,71.7 83.3,71.6 82.45,71.6 v82.04,72.01
  Bottom 0.203: v71.43,81.1 71.43,79.43 71.37,79.38 71.37,73.41 74.17,70.61 82.55,70.61 82.68,70.74 82.68,71.37 v82.04,72.01
RESET  (via drill 0.25)  (1 unrouted)
  Top 0.152: TP1.10 92.44,76.35 94.23,74.55 94.23,73.79 94.11,73.66 v93.47,73.66 | U2.58 80.26,79.75 80.26,77.82 v80.17,77.72 | R19.2 63.12,82.74 S2.4 S2.3 62.48,75.06 v62.48,76.2 | v70.61,75.18 72.26,76.84 75.82,76.84 v76.45,77.47
  Bottom 0.152: v93.47,73.66 90.3,73.66 89.15,74.8 89.15,75.59 88.62,76.12 86.54,76.12 85.72,75.31 81.79,75.31 80.26,76.84 | 79.63,77.47 80.58,76.52 | v70.61,75.18 63.5,75.18 v62.48,76.2 | 79.63,77.47 v76.45,77.47 | v80.17,77.72 79.88,77.72 79.63,77.47
STLB  (via drill 0.25)
  Top 0.152: U2.70 86.23,78.89 86.44,78.68 86.44,76.81 v86.16,76.53 | v102.57,79.32 103.7,80.45 104.14,80.45 R1.1
  Bottom 0.152: v86.16,76.53 87.04,76.53 87.69,77.19 87.69,78.2 88.52,79.03 88.7,79.03 90.12,79.03 90.63,78.51 92.73,78.51 93.38,79.16 96.12,79.16 97.41,77.87 101.12,77.87 v102.57,79.32
STLR  (via drill 0.25)
  Top 0.152: U2.69 85.73,78.6 v85.88,78.45 | v101.6,79.32 | v101.6,79.32 103.7,77.22 R2.1
  Bottom 0.152: v85.88,78.45 87.51,78.45 88.4,79.34 90.24,79.34 90.76,78.82 92.6,78.82 93.25,79.46 96.25,79.46 97.22,78.49 97.46,78.25 97.53,78.17 100.46,78.17 v101.6,79.32
TCK/SWCLK
  Top 0.152: TP1.4 90.66,72.54 89.79,73.41 84.45,73.41 82.42,75.44 82.42,76.71 82.55,76.84 82.55,78.61 82.73,78.79 U2.63
TMS/SWDIO  (via drill 0.25)
  Top 0.152: TP1.2 90.95,75.08 89.66,73.79 84.91,73.79 v84.2,74.5 | v79.25,76.84 79.25,77.85 79.73,78.33 U2.57
  Bottom 0.152: v84.2,74.5 81.58,74.5 v79.25,76.84
VDDCORE  (via drill 0.25)
  Top 0.152: U2.18 80.26,95.33 80.26,96.39 80.57,96.7 C7.2 | U2.86 90.53,86.49 91.57,86.49 | 91.57,86.49 91.77,86.28 C11.2 | U2.76 92.07,81.53 92.15,81.61 | 92.15,81.61 C10.2 | C9.2 73.09,87.04 U2.39 75.01,87.07 76.25,87.07 77.34,88.16 v77.34,88.27 | 88.65,92.15 89.31,91.49 90.43,91.49 U2.96 91.75,91.54 91.87,91.67 C12.2 | 88.65,92.15 88.65,93.75 88.85,93.96 | 88.85,93.96 | 88.85,93.96 89.15,94.26 89.15,96.16 88.9,96.42 87.43,96.42 87.23,96.22 U2.4 87.19,95.25 87.19,93.93 86.68,93.42 85.7,93.42 85.65,93.42 84.74,92.51 v84.28,92.51 | 91.57,86.49 91.57,86.94 v91.8,87.17 | U2.18 80.26,95.25 | C8.2 78.1,96.7 78.1,96.52 78.23,96.39 U2.22 78.23,93.43 79.15,92.51 v80.26,92.51 80.26,93.61 80.41,93.76 80.41,94.26 80.23,94.45 U2.18 | 88.65,92.15 v87.88,92.15 | 92.15,81.61 92.15,81.78 v91.85,82.09
  Bottom 0.152: v84.28,92.51 v80.26,92.51 80.26,90.42 78.36,88.52 77.6,88.52 v77.34,88.27 | v87.88,92.15 87.45,91.72 87.45,89.03 89.31,87.17 v91.8,87.17 91.85,87.12 v91.85,82.09

### Text on the board
tPlace: 40 | 39 | 38 | 37 | 36 | 35 | 34 | 33 | 32 | 31 | 30 | 29 | TP1 | TP2 | 28 | 27 | 26 | 25 | 24 | 23 | 22 | 21 | 20 | 19 | 18 | 17 | 16 | 15 | 14 | 13 | 12 | 11 | TP4 | TP3 | tinyrouter v0.3 | 10 | 9 | 8 | 7 | 6 | 5 | 4 | 3 | 2
bPlace: the best material model of a cat / is another, or preferably the same / cat